# Altium schematic sheet LIDO-HW.100.Page_7.SchDoc
size A3; SheetNumber: 11; SheetTotal: 14
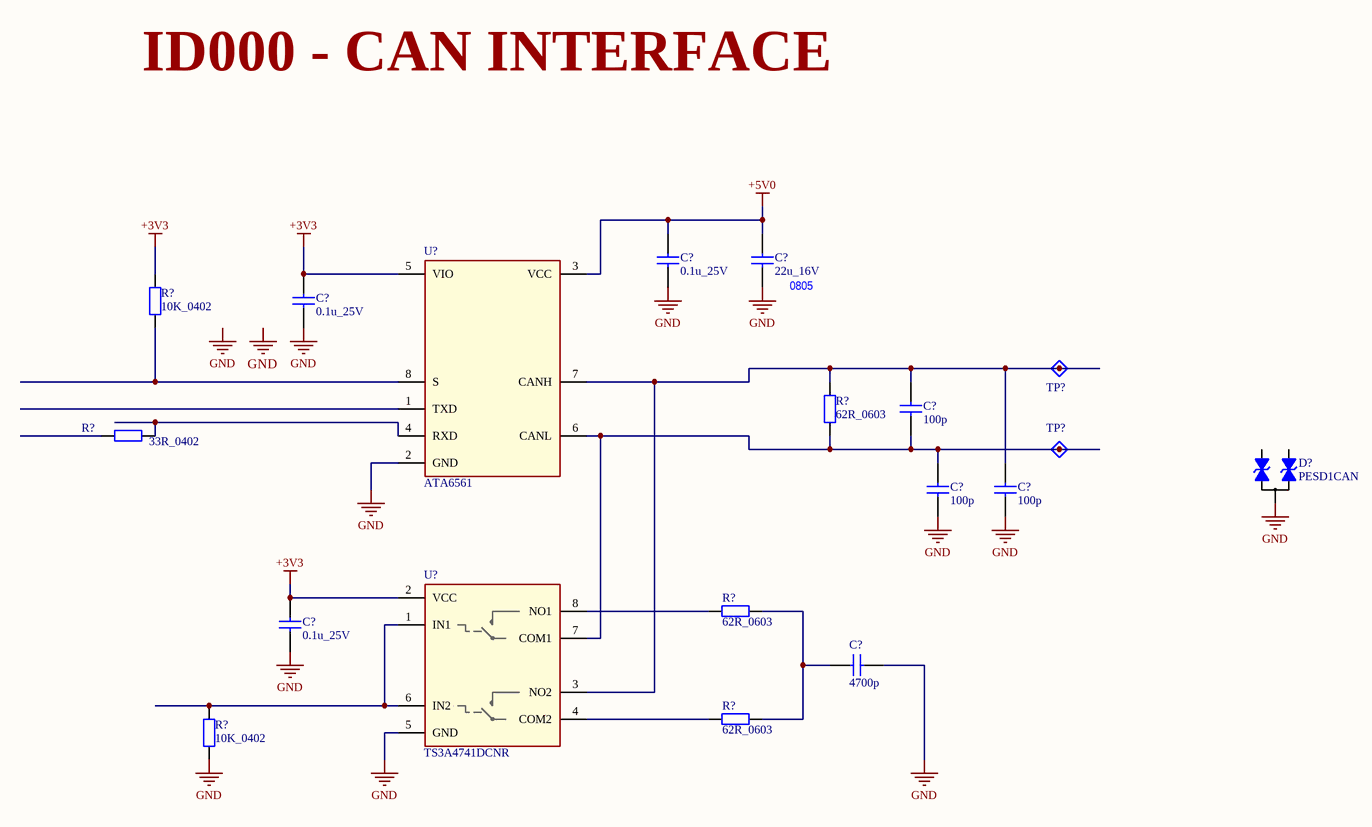
[diagram p0: LIDO-HW.100.Page_7.SchDoc]

## Parts
(Parts that share a designator on the sheet are numbered #1, #2 ... from top to bottom, then left to right.)
C?#1  0.1u_25V
C?#2  22u_16V
C?#3  0.1u_25V
C?#4  100p
C?#5  100p
C?#6  100p
C?#7  0.1u_25V
C?#8  4700p
D?  PESD1CAN
R?#1  10K_0402
R?#2  62R_0603
R?#3  33R_0402
R?#4  62R_0603
R?#5  62R_0603
R?#6  10K_0402
TP?#1  TestPoint_A  (value not drawn)  (no BOM)
TP?#2  TestPoint_A  (value not drawn)  (no BOM)
U?#1  ATA6561  [SOIC8P127_490X600X175L83X42N]
U?#2  TS3A4741DCNR  [TSOP65P280X145-8N]

## Nets
+3V3: C?#3.1 C?#7.1 R?#1.1 U?#1.5(VIO) U?#2.2(VCC)
+5V0: C?#1.1 C?#2.1 U?#1.3(VCC)
GND: C?#1.2 C?#2.2 C?#3.2 C?#5.2 C?#6.1 C?#7.2 C?#8.2 D?.3 R?#6.2 U?#1.2(GND) U?#2.5(GND)
NetC?#4_1: C?#4.1 C?#6.2 R?#2.1 TP?#1.1(TP) U?#1.7(CANH) U?#2.3(NO2)
NetC?#4_2: C?#4.2 C?#5.1 R?#2.2 TP?#2.1(TP) U?#1.6(CANL) U?#2.7(COM1)
NetC?#8_1: C?#8.1 R?#4.1 R?#5.1
NetR?#1_2: R?#1.2 U?#1.8(S)
NetR?#3_1: R?#3.1 U?#1.4(RXD)
NetR?#4_2: R?#4.2 U?#2.8(NO1)
NetR?#5_2: R?#5.2 U?#2.4(COM2)
NetR?#6_1: R?#6.1 U?#2.1(IN1) U?#2.6(IN2)

Not connected (* = marked no-connect by the designer): D? 1 2; R?#3 2; U?#1 1(TXD)

## Notes on the sheet
- ID000 - CAN INTERFACE
- (near C?#2) 0805
- Labels drawn without touching a wire or pin: GND
- Title:
- Size:
- Date:
- A3
- Sheet       of
- Engineer:
- Version:
- Part Number:
- Revision:
- Rev. date:
- Project:
- File:

## Library data of the parts
C?#1-C?#8 = Ceramic: Ceramic CAP Symbol
D? = Double Bi-TVS_B: Double bidirectional ESD protection diodes
R?#1-R?#6 = Resistor: Resistor Symbol
TP?#1 TP?#2 = TestPoint_A: Test Point Symbol verion A; 00_Name: TP_XXmm; 01_Diameter: 1mm; 02_Layer: *
U?#1 = ATA6561_A: IC TRANSCEIVER 1/1 8SO; Manufacturer: Microchip Technology; Manufacturer Part Number: ATA6561-GAQW; Designer: Matt Drazenovich; Ratings: RoHS; Reviewed: Dekimo_07-07-2020; Case/Package: 8-SOIC; ComponentType: IC; Design Date: 22-11-2019; Max Operating Temperature: 150°C; Min Operating Temperature: -40°C; Value: ATA6561
U?#2 = TS3A4741D_A: 2 Circuit IC Switch 1:1 900mOhm SOT-23-8; Manufacturer: Texas Instruments; Designer: Matt Drazenovich; Ratings: RoHS; Reviewed: Not Footprint; Case/Package: SOT-23-8; ComponentType: IC; Design Date: 09-09-2021; Manufacturer Part Number: TS3A4741DCNR; Max Operating Temperature: 85°C; Min Operating Temperature: -40°C; Value: TS3A4741DCNR